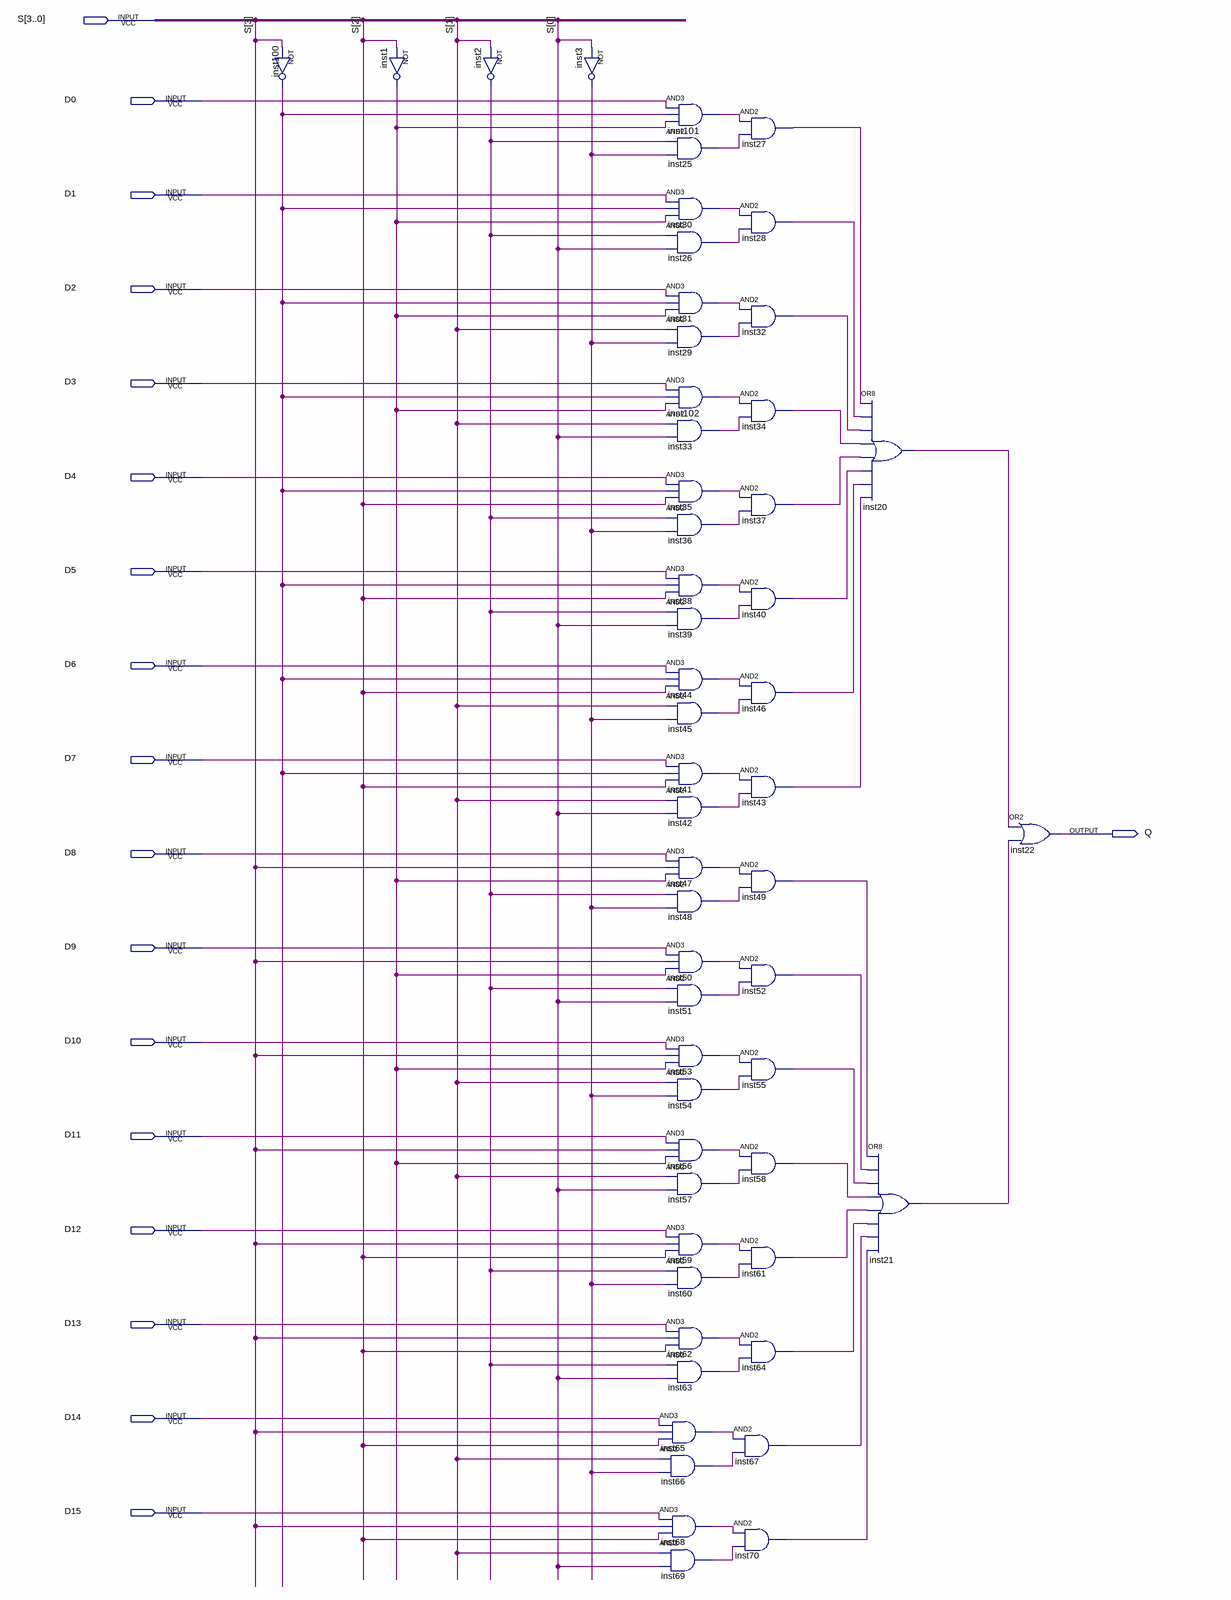
[diagram p0: schematic sheet]
// Quartus schematic SixteenWayEightBitMultiplexer.bdf as structural Verilog: 55 symbols, 18 pins
module SixteenWayEightBitMultiplexer (
  input  [3:0] S,
  input  D0,
  input  D1,
  input  D2,
  input  D3,
  input  D4,
  input  D5,
  input  D6,
  input  D7,
  input  D8,
  input  D9,
  input  D10,
  input  D11,
  input  D12,
  input  D13,
  input  D14,
  input  D15,
  output Q
);

  wire inst1_out, inst2_out, inst3_out, inst20_out, inst21_out, inst25_out, inst26_out, inst27_out,
       inst28_out, inst29_out, inst30_out, inst31_out, inst32_out, inst33_out, inst34_out, inst35_out,
       inst36_out, inst37_out, inst38_out, inst39_out, inst40_out, inst41_out, inst42_out, inst43_out,
       inst44_out, inst45_out, inst46_out, inst47_out, inst48_out, inst49_out, inst50_out, inst51_out,
       inst52_out, inst53_out, inst54_out, inst55_out, inst56_out, inst57_out, inst58_out, inst59_out,
       inst60_out, inst61_out, inst62_out, inst63_out, inst64_out, inst65_out, inst66_out, inst67_out,
       inst68_out, inst69_out, inst70_out, inst100_out, inst101_out, inst102_out;

  not inst100 (inst100_out, S[3]);
  not inst1 (inst1_out, S[2]);
  not inst2 (inst2_out, S[1]);
  not inst3 (inst3_out, S[0]);
  and inst65 (inst65_out, D14, S[3], S[2]);
  and inst66 (inst66_out, S[1], inst3_out);
  and inst68 (inst68_out, D15, S[3], S[2]);
  and inst69 (inst69_out, S[1], S[0]);
  and inst101 (inst101_out, D0, inst100_out, inst1_out);
  and inst25 (inst25_out, inst2_out, inst3_out);
  and inst30 (inst30_out, D1, inst100_out, inst1_out);
  and inst26 (inst26_out, inst2_out, S[0]);
  and inst31 (inst31_out, D2, inst100_out, inst1_out);
  and inst29 (inst29_out, S[1], inst3_out);
  and inst102 (inst102_out, D3, inst100_out, inst1_out);
  and inst33 (inst33_out, S[1], S[0]);
  and inst35 (inst35_out, D4, inst100_out, S[2]);
  and inst36 (inst36_out, inst2_out, inst3_out);
  and inst38 (inst38_out, D5, inst100_out, S[2]);
  and inst39 (inst39_out, inst2_out, S[0]);
  and inst44 (inst44_out, D6, inst100_out, S[2]);
  and inst45 (inst45_out, S[1], inst3_out);
  and inst41 (inst41_out, D7, inst100_out, S[2]);
  and inst42 (inst42_out, S[1], S[0]);
  and inst47 (inst47_out, D8, S[3], inst1_out);
  and inst48 (inst48_out, inst2_out, inst3_out);
  and inst50 (inst50_out, D9, S[3], inst1_out);
  and inst51 (inst51_out, inst2_out, S[0]);
  and inst53 (inst53_out, D10, S[3], inst1_out);
  and inst54 (inst54_out, S[1], inst3_out);
  and inst56 (inst56_out, D11, S[3], inst1_out);
  and inst57 (inst57_out, S[1], S[0]);
  and inst59 (inst59_out, D12, S[3], S[2]);
  and inst60 (inst60_out, inst2_out, inst3_out);
  and inst62 (inst62_out, D13, S[3], S[2]);
  and inst63 (inst63_out, inst2_out, S[0]);
  and inst27 (inst27_out, inst101_out, inst25_out);
  and inst28 (inst28_out, inst30_out, inst26_out);
  and inst32 (inst32_out, inst31_out, inst29_out);
  and inst34 (inst34_out, inst102_out, inst33_out);
  and inst37 (inst37_out, inst35_out, inst36_out);
  and inst40 (inst40_out, inst38_out, inst39_out);
  and inst46 (inst46_out, inst44_out, inst45_out);
  and inst43 (inst43_out, inst41_out, inst42_out);
  and inst49 (inst49_out, inst47_out, inst48_out);
  and inst52 (inst52_out, inst50_out, inst51_out);
  and inst55 (inst55_out, inst53_out, inst54_out);
  and inst58 (inst58_out, inst56_out, inst57_out);
  and inst61 (inst61_out, inst59_out, inst60_out);
  and inst64 (inst64_out, inst62_out, inst63_out);
  and inst67 (inst67_out, inst65_out, inst66_out);
  and inst70 (inst70_out, inst68_out, inst69_out);
  or inst20 (inst20_out, inst27_out, inst28_out, inst32_out, inst34_out, inst37_out, inst40_out, inst46_out, inst43_out);
  or inst21 (inst21_out, inst49_out, inst52_out, inst55_out, inst58_out, inst61_out, inst64_out, inst67_out, inst70_out);
  or inst22 (Q, inst20_out, inst21_out);
endmodule
